# Altium schematic sheet MOTOR.SchDoc: =ProjectName
size A4; CheckedBy: DatNB; Author: Ven; CompanyName: Nacentech; Organization: IMET
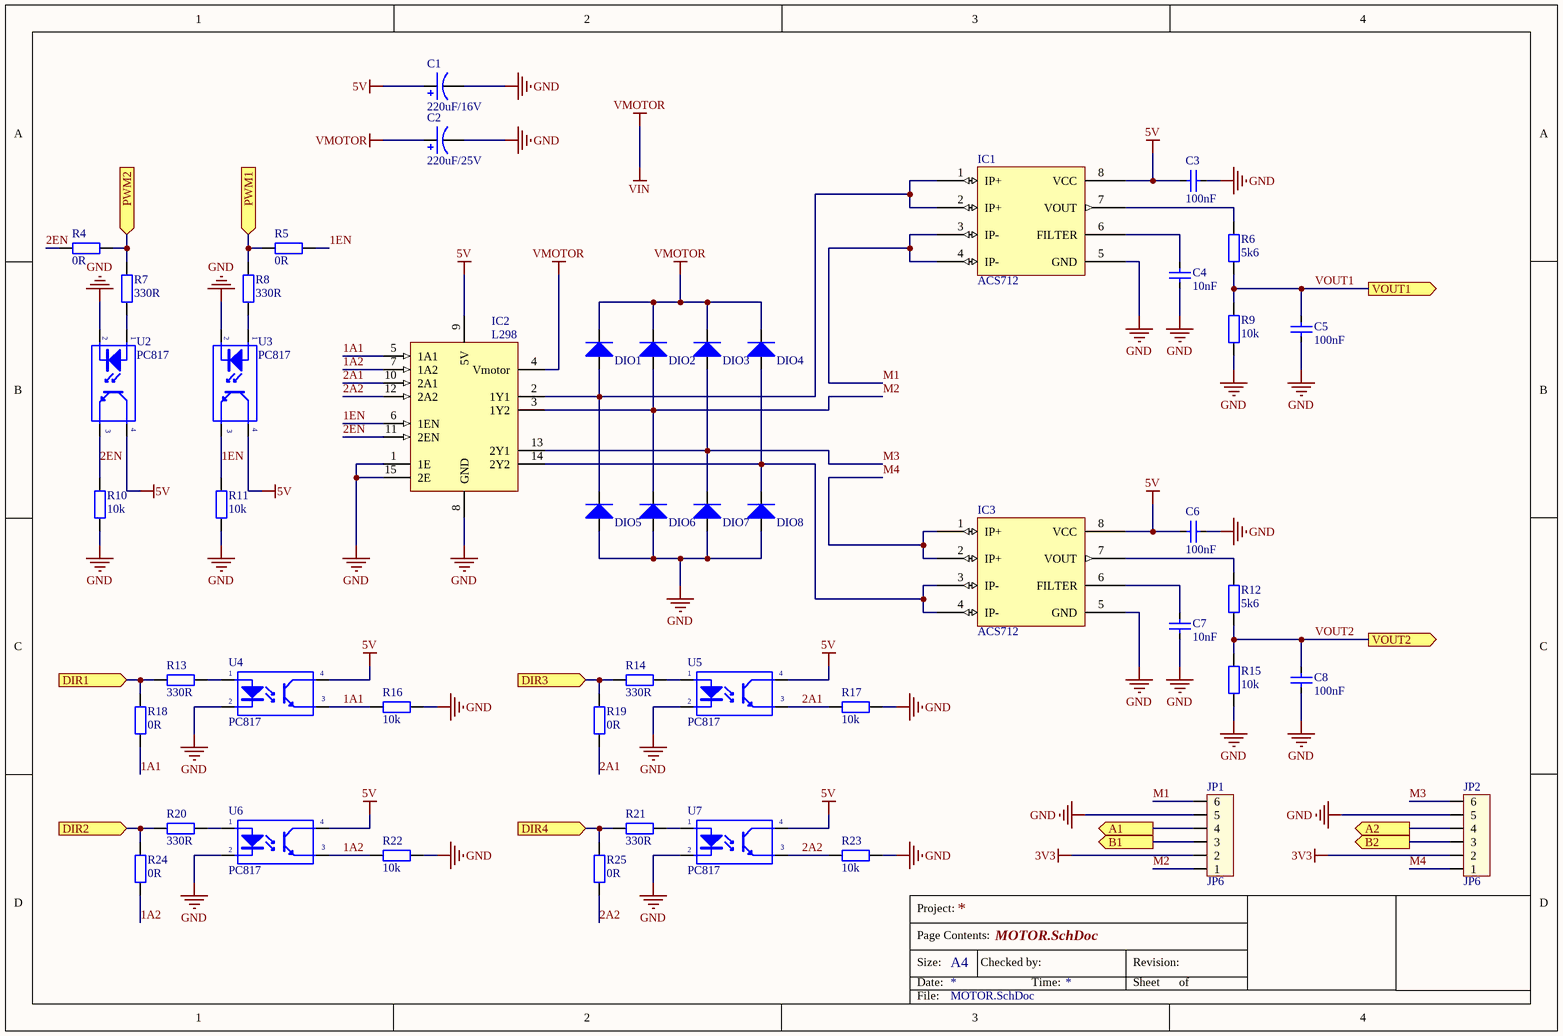
[diagram p0: MOTOR.SchDoc]

## Parts
C1  220uF/16V  [C8mm]
C2  220uF/25V  [C8mm]
C3  100nF  [CAP_0805]
C4  10nF  [CAP_0805]
C5  100nF  [CAP_0805]
C6  100nF  [CAP_0805]
C7  10nF  [CAP_0805]
C8  100nF  [CAP_0805]
DIO1  Diode SMD  [DIO-214AC(SMA)]  (value not drawn)
DIO2  Diode SMD  [DIO-214AC(SMA)]  (value not drawn)
DIO3  Diode SMD  [DIO-214AC(SMA)]  (value not drawn)
DIO4  Diode SMD  [DIO-214AC(SMA)]  (value not drawn)
DIO5  Diode SMD  [DIO-214AC(SMA)]  (value not drawn)
DIO6  Diode SMD  [DIO-214AC(SMA)]  (value not drawn)
DIO7  Diode SMD  [DIO-214AC(SMA)]  (value not drawn)
DIO8  Diode SMD  [DIO-214AC(SMA)]  (value not drawn)
IC1  ACS712  [SOIC-8]
IC2  L298  [DIP15SL2]
IC3  ACS712  [SOIC-8]
JP1  JP6  [CON6]
JP2  JP6  [CON6]
R4  0R  [RES-SMD-0805]
R5  0R  [RES-SMD-0805]
R6  5k6  [RES-SMD-0805]
R7  330R  [RES-SMD-0805]
R8  330R  [RES-SMD-0805]
R9  10k  [RES-SMD-0805]
R10  10k  [RES-SMD-0805]
R11  10k  [RES-SMD-0805]
R12  5k6  [RES-SMD-0805]
R13  330R  [RES-SMD-0805]
R14  330R  [RES-SMD-0805]
R15  10k  [RES-SMD-0805]
R16  10k  [RES-SMD-0805]
R17  10k  [RES-SMD-0805]
R18  0R  [RES-SMD-0805]
R19  0R  [RES-SMD-0805]
R20  330R  [RES-SMD-0805]
R21  330R  [RES-SMD-0805]
R22  10k  [RES-SMD-0805]
R23  10k  [RES-SMD-0805]
R24  0R  [RES-SMD-0805]
R25  0R  [RES-SMD-0805]
U2  PC817  [OPTO_SMD]
U3  PC817  [OPTO_SMD]
U4  PC817  [OPTO_SMD]
U5  PC817  [OPTO_SMD]
U6  PC817  [OPTO_SMD]
U7  PC817  [OPTO_SMD]

## Ports
A1 (out), A2 (out), B1 (out), B2 (out), DIR1 (in), DIR2 (in), DIR3 (in), DIR4 (in), PWM1 (in), PWM2 (in), VOUT1 (out), VOUT2 (out)

## Nets
3V3: JP1.2 JP2.2
5V: C1.1 C3.2 C6.2 IC1.8(VCC) IC2.9(5V) IC3.8(VCC) U2.4(C) U3.4(C) U4.4(C) U5.4(C) U6.4(C) U7.4(C)
GND: C1.2 C2.2 C3.1 C4.1 C5.1 C6.1 C7.1 C8.1 DIO5.1(A) DIO6.1(A) DIO7.1(A) DIO8.1(A) IC1.5(GND) IC2.1(1E) IC2.8(GND) IC2.15(2E) IC3.5(GND) JP1.5 JP2.5 R9.2 R10.2 R11.2 R15.2 R16.2 R17.2 R22.2 R23.2 U2.2(K) U3.2(K) U4.2(K) U5.2(K) U6.2(K) U7.2(K)
VIN: C2.1 DIO1.2(K) DIO2.2(K) DIO3.2(K) DIO4.2(K) IC2.4(Vmotor)  [also labelled VMOTOR]
1A1: IC2.5(1A1) R16.1 R18.1 U4.3(E)
1A2: IC2.7(1A2) R22.1 R24.1 U6.3(E)
1EN: IC2.6(1EN) R5.1 R11.1 U3.3(E)
2A1: IC2.10(2A1) R17.1 R19.1 U5.3(E)
2A2: IC2.12(2A2) R23.1 R25.1 U7.3(E)
2EN: IC2.11(2EN) R4.1 R10.1 U2.3(E)
A1: JP1.4 ; port A1
A2: JP2.4 ; port A2
B1: JP1.3 ; port B1
B2: JP2.3 ; port B2
DIR1: R13.1 R18.2 ; port DIR1
DIR2: R20.1 R24.2 ; port DIR2
DIR3: R14.1 R19.2 ; port DIR3
DIR4: R21.1 R25.2 ; port DIR4
M1: IC1.3(IP-) IC1.4(IP-) JP1.6
M2: DIO2.1(A) DIO6.2(K) IC2.3(1Y2) JP1.1
M3: DIO3.1(A) DIO7.2(K) IC2.13(2Y1) JP2.6
M4: IC3.1(IP+) IC3.2(IP+) JP2.1
PWM1: R5.2 R8.2 ; port PWM1
PWM2: R4.2 R7.2 ; port PWM2
VOUT1: C5.2 R6.2 R9.1 ; port VOUT1
VOUT2: C8.2 R12.2 R15.1 ; port VOUT2
NetC4_2: C4.2 IC1.6(FILTER)
NetC7_2: C7.2 IC3.6(FILTER)
NetDIO1_1: DIO1.1(A) DIO5.2(K) IC1.1(IP+) IC1.2(IP+) IC2.2(1Y1)
NetDIO4_1: DIO4.1(A) DIO8.2(K) IC2.14(2Y2) IC3.3(IP-) IC3.4(IP-)
NetIC1_7: IC1.7(VOUT) R6.1
NetIC3_7: IC3.7(VOUT) R12.1
NetR7_1: R7.1 U2.1(A)
NetR8_1: R8.1 U3.1(A)
NetR13_2: R13.2 U4.1(A)
NetR14_2: R14.2 U5.1(A)
NetR20_2: R20.2 U6.1(A)
NetR21_2: R21.2 U7.1(A)

## Notes on the sheet
- Project:
- Page Contents:
- Size:
- Date:
- A4
- Checked by:
- Time:
- Revision:
- Sheet
- of
- File:

## Library data of the parts
C1 C2 = Cap Pol: Polarized Capacitor (Axial); Published: 8-Jun-2000; LatestRevisionDate: 17-Jul-2002; LatestRevisionNote: Re-released for DXP Platform.; PackageReference: POLAR0.8; Publisher: Altium Limited
C3-C8 = CapSMD: Capacitor; Value: 33p; Published: 8-Jun-2000; LatestRevisionDate: 17-Jul-2002; LatestRevisionNote: Re-released for DXP Platform.; PackageReference: RAD-0.3; Publisher: Altium Limited
DIO1-DIO8 = Diode SMD: Default Diode; Code - JEDEC: DO-214-AB; Value: 1N5007; Published: 8-Jun-2000; Revision: July-2002: Re-released for DXP Platform.; Publisher: Altium Limited
IC2 = L298: Dual Full-H Driver; Note: The tab is elec is connected to GND pin; Published: 15-May-2002; DatasheetVersion: Jun-1990; PackageReference: KV015; Publisher: Altium Limited; PackageDescription: TO, Thru-Hole, Vertical, Heatsink Mounted; 15 Bent Staggered Leads; Pitch 1.27 mm; ComponentLink1Description: Manufacturer Link; ComponentLink1URL: http://www.ti.com/
JP1 JP2 = Con6: Connector 6; Value: Connector 6
R4-R25 = Resistor - SMD: Resistor SMD; Manufacturer: Generic Components; Class: Passive; Published: 08/06/2000; Publisher: Altium Hobart Technology Centre
U2-U7 = PC817: Single Opto; Value: PC817